# EAGLE design Geiger_Counter (EAGLE 6.6.0)
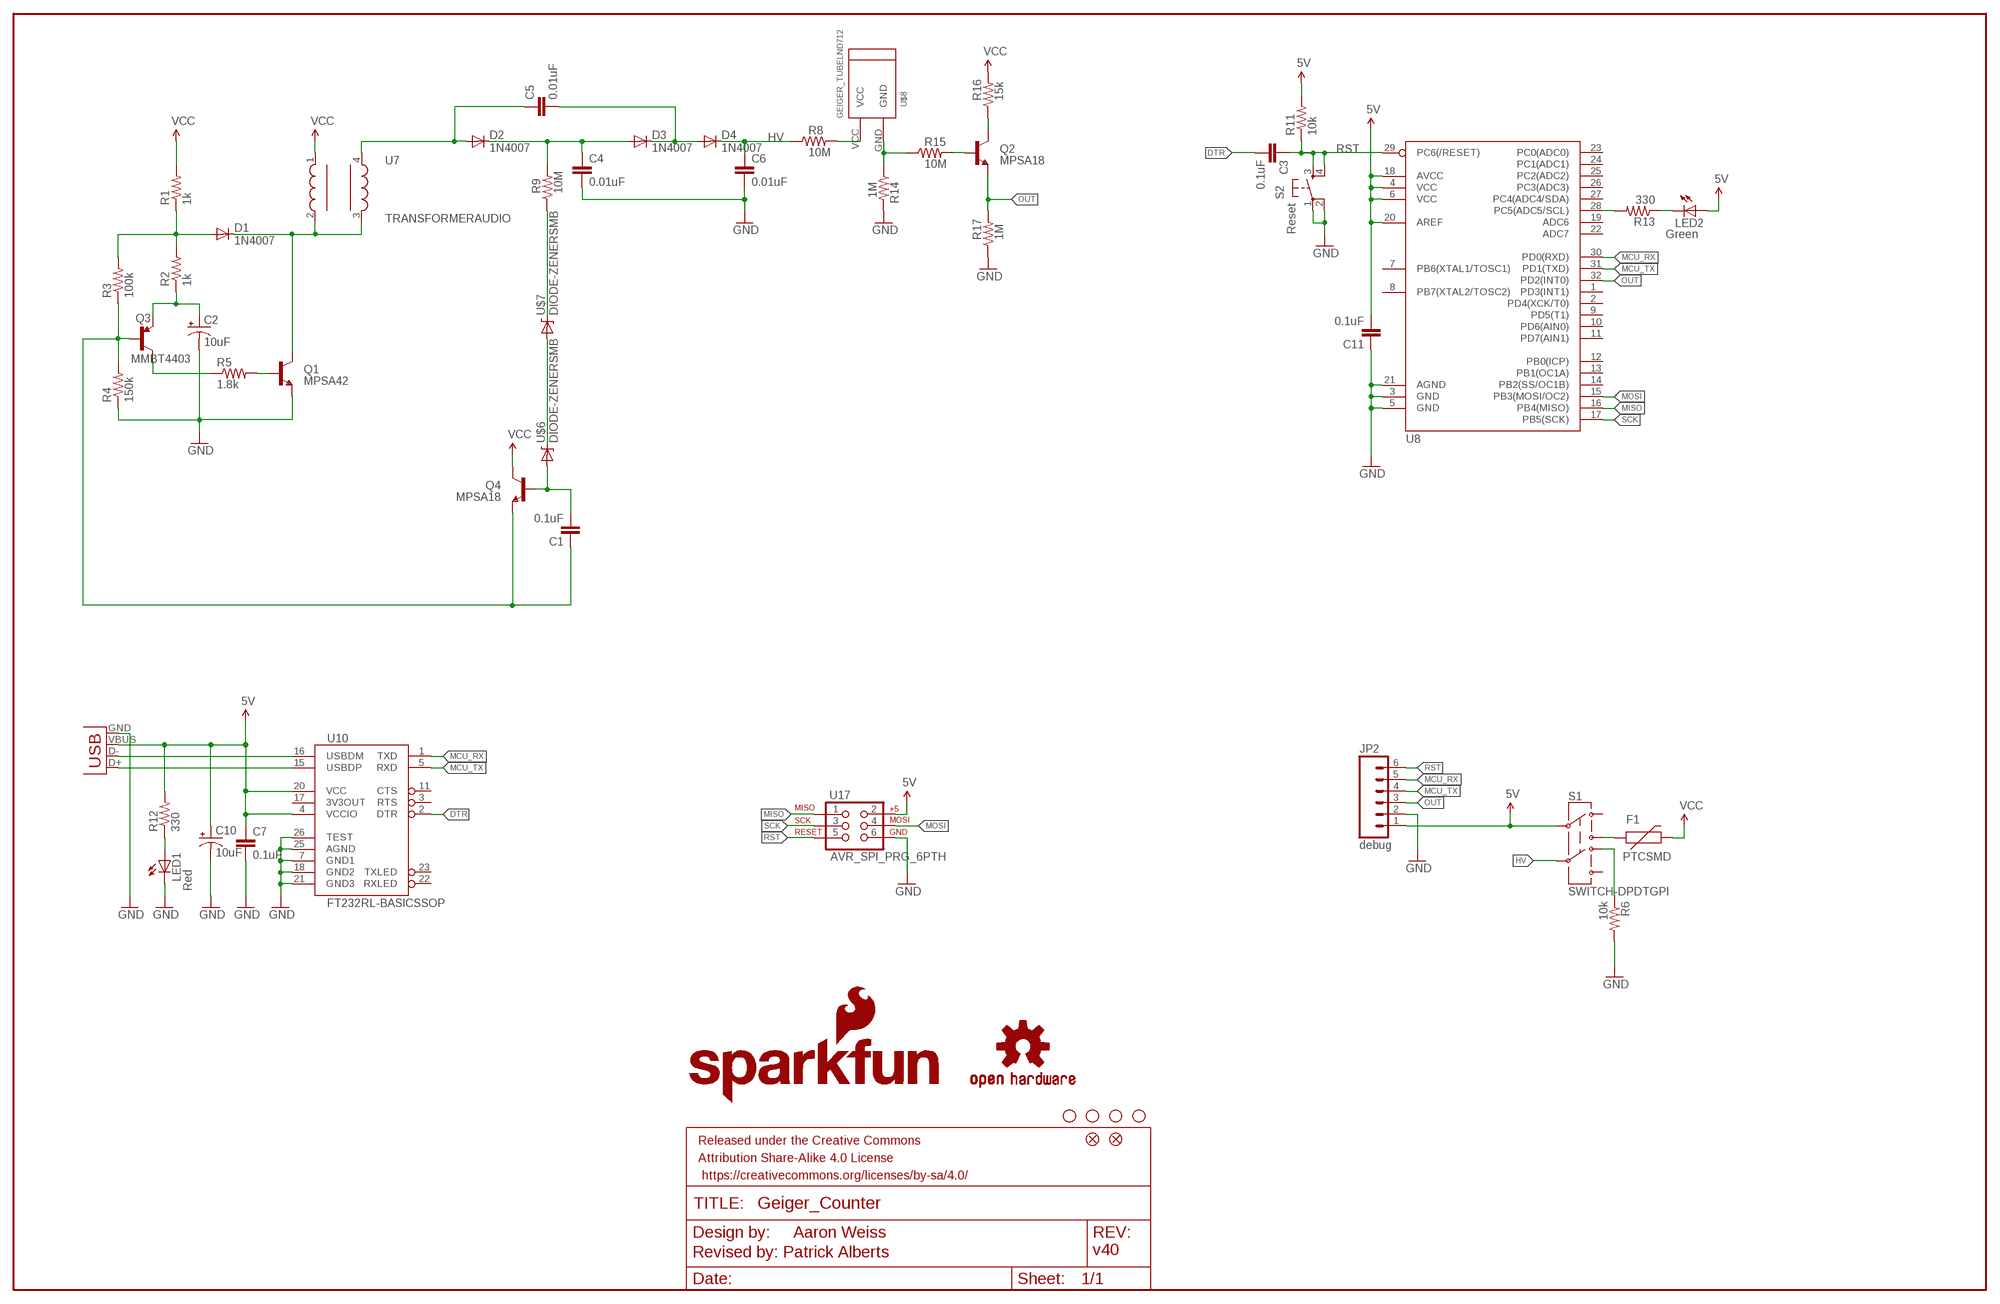
[diagram p0: schematic, sheet 1]

## Parts
C1  0.1uF  0.1UF-25V(+80/-20%)(0603)  [0603-CAP]
C2  10uF  CAP_POL1206  [EIA3216]
C3  0.1uF  0.1UF-25V(+80/-20%)(0603)  [0603-CAP]
C4  0.01uF  CAPPTH3  [CAP-PTH-LARGE]
C5  0.01uF  CAPPTH3  [CAP-PTH-LARGE]
C6  0.01uF  CAPPTH3  [CAP-PTH-LARGE]
C7  0.1uF  0.1UF-25V(+80/-20%)(0603)  [0603-CAP]
C10  10uF  CAP_POL1206  [EIA3216]
C11  0.1uF  0.1UF-25V(+80/-20%)(0603)  [0603-CAP]
D1  1N4007  DIODEHV  [DIODE-HV]
D2  1N4007  DIODEPTH  [DIODE-1N4001]
D3  1N4007  DIODEPTH  [DIODE-1N4001]
D4  1N4007  DIODEPTH  [DIODE-1N4001]
F1  PTCSMD  [PTC-1206]
FID1  FIDUCIAL1X2  [FIDUCIAL-1X2]
FID2  FIDUCIAL1X2  [FIDUCIAL-1X2]
FRAME2  FRAME-LEDGER  [CREATIVE_COMMONS]
JP2  debug  M06SIP  [1X06]
LED1  Red  LED1206  [LED-1206]
LED2  Green  LED1206  [LED-1206]
LOGO1  OSHW-LOGOM  [OSHW-LOGO-M]
LOGO2  SFE_LOGO_NAME_FLAME.1_INCH  [SFE_LOGO_NAME_FLAME_.1]
Q1  MPSA42  TRANSISTOR_NPNSOT23-3  [SOT23-3]
Q2  MPSA18  TRANSISTOR_NPNTO92  [TO-92]
Q3  MMBT4403  TRANSISTOR_PNPSMD  [SOT23-3]
Q4  MPSA18  TRANSISTOR_NPNTO92  [TO-92]
R1  1k  1KOHM1/10W1%(0603)  [0603-RES]
R2  1k  1KOHM1/10W1%(0603)  [0603-RES]
R3  100k  100KOHM1/10W1%(0603)  [0603-RES]
R4  150k  150KOHM1/10W1%(0603)  [0603-RES]
R5  1.8k  1.8KOHM1/10W1%(0603)  [0603-RES]
R6  10k  RESISTORAXIAL-0.3  [AXIAL-0.3]
R8  10M  RESISTORAXIAL-0.3  [AXIAL-0.3]
R9  10M  RESISTORAXIAL-0.3  [AXIAL-0.3]
R11  10k  10KOHM1/10W1%(0603)0603  [0603-RES]
R12  330  33OHM1/10W1%(0603)  [0603]
R13  330  330OHM1/10W1%(0603)  [0603-RES]
R14  1M  RESISTORAXIAL-0.3  [AXIAL-0.3]
R15  10M  RESISTORAXIAL-0.3  [AXIAL-0.3]
R16  15k  RESISTORAXIAL-0.3  [AXIAL-0.3]
R17  1M  RESISTORAXIAL-0.3  [AXIAL-0.3]
S1  SWITCH-DPDTGPI  [GPI-152-3013]
S2  Reset  TAC_SWITCHSMD  [TACTILE_SWITCH_SMD]
U7  TRANSFORMERAUDIO  TRANSFORMERPTH  [TRANSFORMER]
U8  ATMEGA328_SMT  [TQFP32-08]
U10  FT232RL-BASICSSOP  [SSOP28DB]
U17  AVR_SPI_PRG_6PTH  [2X3]
U$1  STAND-OFF  [STAND-OFF]
U$2  STAND-OFF  [STAND-OFF]
U$3  STAND-OFF  [STAND-OFF]
U$4  STAND-OFF  [STAND-OFF]
U$6  DIODE-ZENERSMB  [SMB-DIODE]
U$7  DIODE-ZENERSMB  [SMB-DIODE]
U$8  GEIGER_TUBELND712  [GEIGER_TUBE]
X1  USBSMD  [USB-MINIB]

## Nets
5V: C7.1 C10.A(+) C11.2 JP2.1 LED2.A R11.2 R12.2 S1.C@1 U8.4(VCC) U8.6(VCC) U8.18(AVCC) U8.20(AREF) U10.4(VCCIO) U10.20(VCC) U17.2 X1.VBUS
DTR: C3.2 U10.2(DTR)
GND: C2.C(-) C4.2 C6.2 C10.C(-) C11.1 JP2.2 LED1.C Q1.2(E) R4.1 R6.P$2 R14.P$2 R17.P$1 S2.1 S2.2 U8.3(GND) U8.5(GND) U8.21(AGND) U10.7(GND1) U10.18(GND2) U10.21(GND3) U10.25(AGND) U10.26(TEST) U17.6 X1.GND
HV: C6.1 D4.C R8.P$1 S1.C@2
MCU_RX: JP2.5 U8.30(PD0(RXD)) U10.1(TXD)
MCU_TX: JP2.4 U8.31(PD1(TXD)) U10.5(RXD)
MISO: U8.16(PB4(MISO)) U17.1
MOSI: U8.15(PB3(MOSI/OC2)) U17.4
N$1: F1.1 S1.20
N$2: D1.A R1.1 R2.2 R3.2
N$3: R14.P$1 R15.P$1 U$8.GND
N$4: C2.A(+) Q3.2(E) R2.1
N$5: Q2.2(B) R15.P$2
N$6: Q3.3(C) R5.1
N$7: R6.P$1 S1.11
N$8: Q2.3(C) R16.P$1
N$9: Q1.1(B) R5.2
N$10: D1.C Q1.3(C) U7.2 U7.3
N$11: C4.1 D2.C D3.A R9.P$2
N$12: C5.2 D3.C D4.A
N$13: C7.2 ; supply symbol labelled GND
N$14: R8.P$2 U$8.VCC
N$15: U10.16(USBDM) X1.D-
N$17: U10.15(USBDP) X1.D+
N$18: R9.P$1 U$7.C
N$19: LED1.A R12.1
N$20: LED2.C R13.1
N$21: R13.2 U8.28(PC5(ADC5/SCL))
N$22: U$6.C U$7.A
N$23: C1.2 Q4.2(B) U$6.A
OSC1: C5.1 D2.A U7.4
OSC2: C1.1 Q3.1(B) Q4.1(E) R3.1 R4.2
OUT: JP2.3 Q2.1(E) R17.P$2 U8.32(PD2(INT0))
RST: C3.1 JP2.6 R11.1 S2.3 S2.4 U8.29(PC6(/RESET)) U17.5
SCK: U8.17(PB5(SCK)) U17.3
VCC: F1.2 Q4.3(C) R1.2 R16.P$2 U7.1
Unconnected: S1.10 S1.21 U8.1(PD3(INT1)) U8.2(PD4(XCK/T0)) U8.7(PB6(XTAL1/TOSC1)) U8.8(PB7(XTAL2/TOSC2)) U8.9(PD5(T1)) U8.10(PD6(AIN0)) U8.11(PD7(AIN1)) U8.12(PB0(ICP)) U8.13(PB1(OC1A)) U8.14(PB2(SS/OC1B)) U8.19(ADC6) U8.22(ADC7) U8.23(PC0(ADC0)) U8.24(PC1(ADC1)) U8.25(PC2(ADC2)) U8.26(PC3(ADC3)) U8.27(PC4(ADC4/SDA)) U10.3(RTS) U10.11(CTS) U10.17(3V3OUT) U10.22(RXLED) U10.23(TXLED)

## Notes on the sheet
- Aaron Weiss
- Revised by: Patrick Alberts | v40

## Library data of the parts
C1 C3 C7 C11 = SparkFun-Capacitors:0.1UF-25V(+80/-20%)(0603): CAP-00810 Ceramic Standard decoupling cap; PROD_ID: CAP-00810
C2 C10 = SparkFun:CAP_POL: Capacitor Polarized These are standard SMD and PTH capacitors. Normally 10uF, 47uF, and 100uF in electrolytic and tantalum varieties. Always verify the external diameter of the through hole cap, it varies with capacity, voltage, and manufacturer. The EIA devices should be standard.
C4-C6 = SparkFun:CAP: Capacitor Standard 0603 ceramic capacitor, and 0.1" leaded capacitor.
D1-D4 = SparkFun:DIODE: Diode These are standard reverse protection diodes and small signal diodes. SMA package can handle up to about 1A. SOD-323 can handle about 200mA. What the SOD-323 package when ordering, there are some mfgs out there that are 5-pin packages.
F1 = SparkFun:PTC: Resettable Fuse PTC Resettable Fuse. Spark Fun Electronics SKU : COM-08357
FID1 FID2 = SparkFun-Aesthetics:FIDUCIAL: Fiducial Alignment Points Various fiducial points for machine vision alignment.
FRAME2 = SparkFun-Aesthetics:FRAME-LEDGER: Schematic Frame Standard 11x14 US Ledger frame
JP2 = SparkFun:M06: Header 6 Standard 6-pin 0.1" header. Use with straight break away headers (SKU : PRT-00116), right angle break away headers (PRT-00553), swiss pins (PRT-00743), machine pins (PRT-00117), and female headers (PRT-00115). Molex polarized connector foot print use with SKU : PRT-08094 with associated crimp pins and housings. NOTES ON THE VARIANTS LOCK and LOCK_LONGPADS... This footprint was designed to help hold the alignment of a through-hole component (i.e. 6-pin header) while soldering it into place. You may notice that each hole has been shifted either up or down by 0.005 of an inch from it's more standard position (which is a perfectly straight line). This slight alteration caused the pins (the squares in the middle) to touch the edges of the holes. Because they are alternating, it causes a "brace" to hold the component in place. 0.005 has proven to be the perfect amount of "off-center" position when using our standard breakaway headers. Although looks a little odd when you look at the bare footprint, once you have a header in there, the alteration is very hard to notice. Also, if you push a header all the way into place, it is covered up entirely on the bottom side. This idea of altering the position of holes to aid alignment will be further integrated into the Sparkfun Library for other footprints. It can help hold any component with 3 or more connection pins.
LED1 LED2 = SparkFun:LED: LEDs Standard schematic elements and footprints for 5mm, 3mm, 1206, and 0603 sized LEDs. 5mm - Spark Fun Electronics SKU : COM-00529 (and others)
LOGO1 = SparkFun-Aesthetics:OSHW-LOGO: Open Source Hardware Logo This logo indicates the piece of hardware it is found on incorporates a OSHW license and/or adheres to the definition of open source hardware found here: http://freedomdefined.org/OSHW
LOGO2 = SparkFun-Aesthetics:SFE_LOGO_NAME_FLAME: SFE Logo, name and flame This is the SparkFun full logo. The logo on the schematic will always be the same size; the package variant is the height of the flame part of the logo. Default layer for the logo on the board is tSilk.
Q1 Q2 Q4 = SparkFun:TRANSISTOR_NPN: Transistor NPN BJT configuration in SOT23 package. MMBT2222 is the common NPN we use. Double check BCE configuration again layout.
Q3 = SparkFun:TRANSISTOR_PNP
R1 R2 = SparkFun-Resistors:1KOHM1/10W1%(0603): RES-07856; PROD_ID: RES-07856; VALUE: 1K
R3 = SparkFun-Resistors:100KOHM1/10W1%(0603): RES-07828; PROD_ID: RES-07828
R4 = SparkFun-Resistors:150KOHM1/10W1%(0603): RES-09117; PROD_ID: RES-09117
R5 = SparkFun-Resistors:1.8KOHM1/10W1%(0603): RES-09119; PROD_ID: RES-09119
R6 R8 R9 R14-R17 = SparkFun:RESISTOR: Resistor Basic schematic elements and footprints for 0603, 1206, and PTH resistors.
R11 = SparkFun-Resistors:10KOHM1/10W1%(0603): RES-00824; PROD_ID: RES-00824; VALUE: 10K
R12 = SparkFun-Resistors:33OHM1/10W1%(0603): RES-08270; PROD_ID: RES-08270; VALUE: 33OHM
R13 = SparkFun-Resistors:330OHM1/10W1%(0603): RES-00818; PROD_ID: RES-00818
S1 = SparkFun:SWITCH-DPDT: DPDT Version of the COM-00597
S2 = SparkFun:TAC_SWITCH: Momentary Switch Button commonly used for reset or general input. Spark Fun Electronics SKU : COM-00097
U7 = SparkFun:TRANSFORMER
U8 = SparkFun-DigitalIC:ATMEGA328_SMT: 32-Pin Atmega328 part Commonly used on Arduino compatible boards Available in QFP and QFN packages TQFP is IC-09069 QFN is non-stock; PROD_ID: IC-09069; VALUE: ATMEGA328P
U10 = SparkFun:FT232RL-BASIC: USB UART This is the simplified version of the FT232RL unit. Only what you need, nothing you don't. Spark Fun Electronics SKU : COM-00650
U17 = SparkFun:AVR_SPI_PRG_6: AVR ISP 6 Pin This is the reduced ISP connector for AVR programming. Common on Arduino. This footprint will take up less PCB space and can be used with a 10-pin to 6-pin adapter such as SKU: BOB-08508
U$1-U$4 = SparkFun:STAND-OFF: Stand Off This is the mechanical footprint for a #4 phillips button head screw. Use the keepout ring to avoid running the screw head into surrounding components. SKU : PRT-00447
U$6 U$7 = SparkFun-DiscreteSemi:DIODE-ZENER: Zener Diode Production Part - 8199 3.4V Zener Voltage
U$8 = SparkFun:GEIGER_TUBE: LND712 Geiger Tube
X1 = SparkFun:USB: USB Connectors USB-B-PTH is fully proven SKU : PRT-00139 USB-miniB is fully proven SKU : PRT-00587 USB-A-PCB is untested. USB-A-H is throughly reviewed, but untested. Spark Fun Electronics SKU : PRT-00437 USB-B-SMT is throughly reviewed, but untested. Needs silkscreen touching up. USB-A-S has not been used/tested USB-MB-H has not been used/tested

## Board
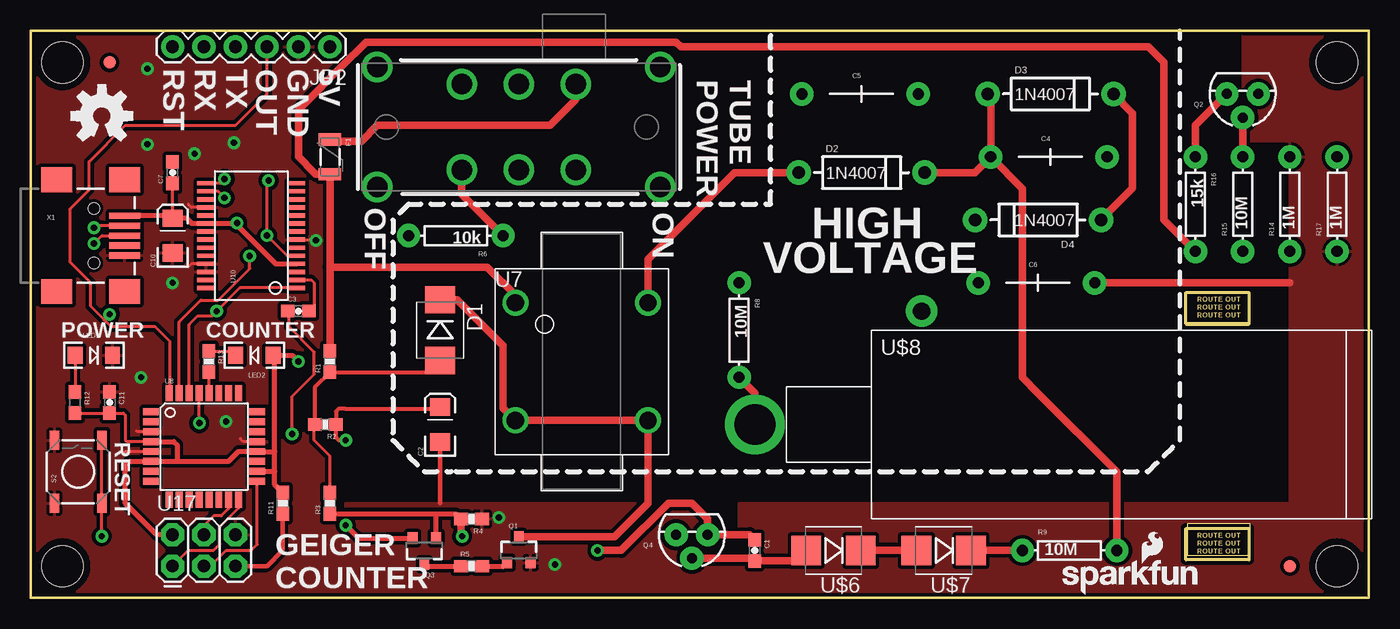
[diagram p1: board, top side]
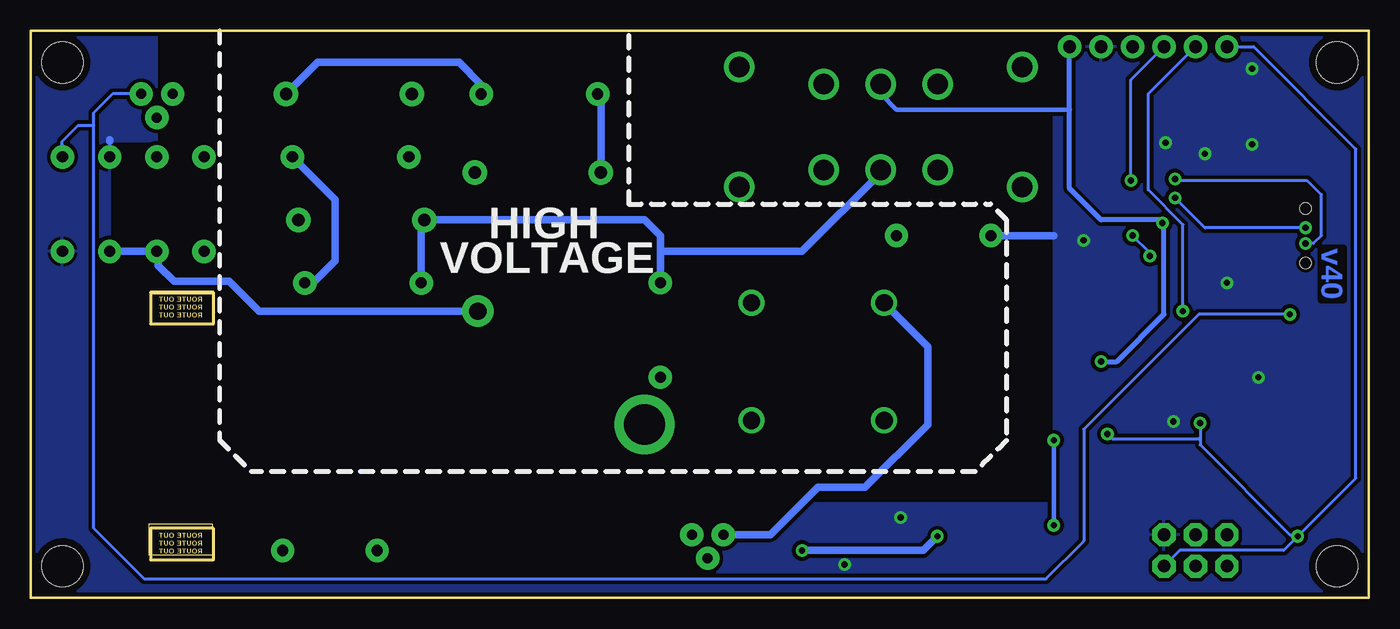
[diagram p2: board, bottom side, seen from below]

Size 107.95 x 45.72 mm. Coordinates in mm from the lower left corner, seen from the top.
Outline: 0,0 107.95,0 107.95,45.72 0,45.72 0,0
Outline: 93.22,24.64 98.3,24.64 98.3,22.1 93.22,22.1 93.22,24.64
Outline: 93.22,5.59 98.3,5.59 98.3,3.05 93.22,3.05 93.22,5.59
Copper layers (1*16): Top 0.035mm / dielectric 1.5mm / Bottom 0.035mm
Design rules "SparkFun-2-layer": minimum track width 7mil, minimum drill 15mil, track to track 8mil, track to pad 8mil, pad to pad 8mil, via to via 8mil, smd to smd 8mil, copper to edge 8mil, drill to drill 8mil, minimum pad ring 12mil, minimum via ring 10mil, stop-mask expansion 4mil, vias tented up to drill 20mil, thermal gap 10mil
Milling: area 93.2,22 to 98.3,24.5; area 93.3,3.4 to 98.4,6

### Footprints (pad centres in the part's own frame; a part is rotated, then mirrored left to right if it is on the bottom)
0603-CAP = smd 1.1 x 1: 1 -0.85,0; 2 0.85,0
EIA3216 = smd 1.4 x 1.6: A 1.4,0; C -1.4,0
CAP-PTH-LARGE = drill 0.9 pad 1.905: 1 -4.826,0; 2 4.572,0
DIODE-HV = smd 2.2 x 2.4: A 2.454,0; C -2.454,0
DIODE-1N4001 = drill 1 pad 1.981: A -5.08,0; C 5.08,0
PTC-1206 = smd 1 x 1.8: 1 -1.4,0; 2 1.4,0
FIDUCIAL-1X2 = smd 1 x 1: 1 0,0
1X06 = drill 1.016 pad 1.88: 1 0,0; 2 2.54,0; 3 5.08,0; 4 7.62,0; 5 10.16,0; 6 12.7,0
LED-1206 = smd 1.2 x 1.4: A -1.5,0; C 1.5,0
SOT23-3 = smd 0.8 x 0.9: 1 -0.95,-1; 2 0.95,-1; 3 0,1.1
TO-92 = drill 0.813 pad 1.88: 1 -1.27,0; 2 0,1.905; 3 1.27,0
0603-RES = smd 1.1 x 1: 1 -0.85,0; 2 0.85,0
AXIAL-0.3 = drill 0.9 pad 1.88: P$1 -3.81,0; P$2 3.81,0
0603 = smd 1.1 x 1: 1 -0.85,0; 2 0.85,0
GPI-152-3013 = drill 1.65: 10 -4.6,3.455; 11 -4.6,-3.455; 20 4.6,3.455; 21 4.6,-3.455; C@1 0,3.455; C@2 0,-3.455; P$7 11.43,4.85; P$8 -11.43,4.85; P$9 -11.43,-4.85; P$10 11.43,-4.85
TACTILE_SWITCH_SMD = smd 1.524 x 0.762: 1 -2.54,1.905; 2 2.54,1.905; 3 -2.54,-1.905; 4 2.54,-1.905
TRANSFORMER = drill 1.4: 1 -5.35,4.75; 2 -5.35,-4.75; 3 5.35,-4.75; 4 5.35,4.75
TQFP32-08 = smd 1.27 x 0.559: 1 -4.293,2.8; 2 -4.293,2; 3 -4.293,1.2; 4 -4.293,0.4; 5 -4.293,-0.4; 6 -4.293,-1.2; 7 -4.293,-2; 8 -4.293,-2.8; 17 4.293,-2.8; 18 4.293,-2; 19 4.293,-1.2; 20 4.293,-0.4; 21 4.293,0.4; 22 4.293,1.2; 23 4.293,2; 24 4.293,2.8 | smd 0.559 x 1.27: 9 -2.8,-4.293; 10 -2,-4.293; 11 -1.2,-4.293; 12 -0.4,-4.293; 13 0.4,-4.293; 14 1.2,-4.293; 15 2,-4.293; 16 2.8,-4.293; 25 2.8,4.293; 26 2,4.293; 27 1.2,4.293; 28 0.4,4.293; 29 -0.4,4.293; 30 -1.2,4.293; 31 -2,4.293; 32 -2.8,4.293
SSOP28DB = smd 0.348 x 1.397: 1 -4.225,-3.656; 2 -3.575,-3.656; 3 -2.925,-3.656; 4 -2.275,-3.656; 5 -1.625,-3.656; 6 -0.975,-3.656; 7 -0.325,-3.656; 8 0.325,-3.656; 9 0.975,-3.656; 10 1.625,-3.656; 11 2.275,-3.656; 12 2.925,-3.656; 13 3.575,-3.656; 14 4.225,-3.656; 15 4.225,3.656; 16 3.575,3.656; 17 2.925,3.656; 18 2.275,3.656; 19 1.625,3.656; 20 0.975,3.656; 21 0.325,3.656; 22 -0.325,3.656; 23 -0.975,3.656; 24 -1.625,3.656; 25 -2.275,3.656; 26 -2.925,3.656; 27 -3.575,3.656; 28 -4.225,3.656
2X3 = drill 1.016 pad 1.88 octagon: 1 0,0; 2 0,2.54; 3 2.54,0; 4 2.54,2.54; 5 5.08,0; 6 5.08,2.54
STAND-OFF = hole 3.302: 0,0
SMB-DIODE = smd 2.4 x 2.4: A 2.2,0; C -2.2,0
GEIGER_TUBE = drill 1.4 pad 2.54: GND 13.462,9.144 | drill 3.302 pad 4.826: VCC 0,0
USB-MINIB = smd 2.5 x 0.5: D+ 2.5,0; D- 2.5,0.8; GND 2.5,-1.6; ID 2.5,-0.8; VBUS 2.5,1.6 | smd 2.5 x 2: MTN1 -3,4.5; MTN2 2.5,4.5; MTN3 -3,-4.5; MTN4 2.5,-4.5 | hole 0.9: 0,2.2; 0,-2.2

### Placement (x,y rotation side)
C1  58.42,3.81 270 top
C2  33.02,13.97 90 top
C3  21.59,23.11 0 top
C4  82.28,35.56 0 top
C5  67.04,40.64 0 top
C6  81.28,25.4 0 top
C7  11.43,34.29 90 top
C10  11.43,29.21 90 top
C11  6.35,15.75 270 top
D1  33.02,21.59 270 top
D2  67.04,34.29 0 top
D3  82.28,40.64 0 top
D4  81.28,30.48 180 top
F1  24.13,35.56 270 top
FID1  6.35,43.18 0 top
FID2  101.6,2.54 0 top
FRAME2  21.79,-19.05 0 top  (outside the outline)
JP2  24.13,44.45 180 top
LED1  5.08,19.56 0 top
LED2  18.03,19.56 180 top
LOGO1  5.71,38.86 0 top
LOGO2  82.8,0.13 0 top
Q1  39.37,3.81 0 top
Q2  97.79,40.64 180 top
Q3  31.75,3.81 180 top
Q4  53.34,5.08 180 top
R1  24.13,19.05 90 top
R2  23.75,13.97 180 top
R3  24.13,7.62 90 top
R4  35.56,6.35 180 top
R5  35.56,2.54 0 top
R6  34.29,29.21 180 top
R8  57.15,21.59 270 top
R9  83.82,3.81 0 top
R11  20.32,7.62 90 top
R12  3.56,15.75 270 top
R13  14.35,19.05 270 top
R14  101.6,31.75 90 top
R15  97.79,31.75 90 top
R16  93.98,31.75 270 top
R17  105.41,31.75 90 top
S1  39.37,37.97 0 top
S2  3.81,10.16 90 top
U7  44.45,19.05 0 top
U8  13.97,12.19 0 top
U10  17.78,29.21 90 top
U17  11.43,2.54 0 top
U$1  2.54,2.54 0 top
U$2  2.54,43.18 0 top
U$3  105.41,43.18 0 top
U$4  105.41,2.54 0 top
U$6  64.77,3.81 180 top
U$7  73.66,3.81 180 top
U$8  58.42,13.97 0 top
X1  5.08,29.21 0 top

### Tracks (layer width: path | path; a pad name or v marks a point on that pad's centre or on a via)
5V  (via drill 0.51)
  Top 0.254: 11.23,30.81 C10.A C7.1 | 16.6,30.18 v16.64,30.23 16.64,30.06 | R12.2 C11.2 7.45,14.9 7.62,14.73 7.62,12.7 7.73,12.59 U8.4
  Top 0.406: 11.23,30.81 X1.VBUS | C10.A 12.57,30.61 12.99,30.18 U10.20 16.6,30.18 | U10.4 19.76,26.93 16.64,30.06 | 20.32,8.26 R11.2 19.68,9.11 19.68,10.19 | U17.2 10.16,5.08 7.62,7.62 7.62,10.67 7.94,10.99 U8.6 11.89,11 | 19.68,10.19 19.68,11.79 | 18.3,10.16 U8.18 19.68,10.19 | 19.68,11.79 U8.20 16.75,11.8 15.95,11 11.89,11 | v21.59,19.05 21.08,19.56 LED2.A 19.68,19.41 19.68,11.79 | U8.4 11.54,12.59 11.79,12.34 11.79,11.1 11.89,11
  Bottom 0.381: S1.C@1 39.37,40.64 38.1,39.37 24.13,39.37
  Bottom 0.406: v21.59,19.05 20.32,19.05 16.51,22.86 16.51,30.1 v16.64,30.23 16.89,30.48 21.59,30.48 24.13,33.02 24.13,39.37 JP2.1
DTR
  Top 0.254: U10.2 22.62,25.64 22.86,25.4 22.86,23.53 C3.2
GND  (via drill 0.51)
  Top 0.254: U8.3 8.58,13.39 8.51,13.46 | U8.5 7.6,11.79 7.49,11.68 | U8.21 17.13,12.59 16.89,12.83 | U10.18 12.96,31.48 12.7,31.75 | U10.25 12.96,26.93 12.7,26.67 | U10.7 22.93,28.89 v22.99,28.83
  Top 0.356: 33.02,7.62 C2.C
  Top 0.61: C6.2 101.6,25.4
  Bottom 0.61: 25.4,29.21 R6.P$2 | 101.6,36.83 101.6,36.96 | C6.2 85.17,25.4 83.39,27.18 83.39,32.1 C4.2
  other vias: 15.75,14.22 11.43,25.4 42.29,2.67 9.4,42.67 9.4,36.58 16.38,36.7 13.21,35.81 37.77,6.48 8.89,17.78
  pour Bottom (isolate 0.305): 0,45.72 25.4,45.72 25.4,0 0,0
  pour Top (isolate 0.305): 0,45.72 0,0 25.4,0 25.4,45.72
  pour Top (isolate 0.305): 25.4,0 25.4,7.62 58.42,7.62 58.42,0
  pour Bottom (isolate 0.305): 25.4,0 25.4,7.62 58.42,7.62 58.42,0
  pour Bottom (isolate 0.305): 0,7.62 101.6,7.62 101.6,36.83 97.79,36.83 97.79,45.72 107.95,45.72 107.95,0 0,0
  pour Top (isolate 0.305): 57.15,7.62 101.6,7.62 101.6,36.83 97.79,36.83 97.79,45.72 107.95,45.72 107.95,0 57.15,0
HV
  Bottom 0.61: S1.C@2 39.37,34.29 45.72,27.94 57.15,27.94 | C6.1 76.45,30.23 D4.C 58.42,30.48 57.15,29.21 57.15,27.94 | R8.P$1 57.15,27.94
MCU_RX  (via drill 0.51)
  Top 0.254: U8.30 12.77,22.04 13.46,22.73 14.61,22.73 v14.99,23.11 16.86,24.98 U10.1
  Bottom 0.254: v14.99,23.11 14.99,30.1 17.78,32.89 17.78,40.64 JP2.5 | v14.99,23.11 15.11,22.99 | v14.99,23.11 14.99,22.99
MCU_TX  (via drill 0.51)
  Top 0.254: U10.5 20.68,27.59 v19.05,29.21 19.05,33.53 v19.18,33.66 | U8.31 11.97,22.26 13.72,24 15.11,24 17.65,26.54 v17.65,27.56
  Bottom 0.254: v17.65,27.56 17.65,27.81 v19.05,29.21 | v19.18,33.66 19.18,41.78 JP2.4
MISO
  Top 0.254: U17.1 12.7,3.81 14.73,3.81 15.24,4.32 15.24,5.71 16.77,7.25 U8.16
MOSI
  Top 0.254: U8.15 15.97,7.21 15.37,6.6 14.73,6.6 13.97,5.84 U17.4
N$1
  Top 0.381: F1.1 24.26,36.83
  Top 0.61: S1.20 43.97,40.16 41.91,38.1 27.94,38.1 26.67,36.83 24.26,36.83
N$2
  Top 0.254: R3.2 24.13,11.43 22.86,12.7 22.86,13.93 R2.2
  Top 0.305: 32.53,18.65 32.08,18.2 R1.1 22.9,16.97 R2.2
  Top 0.356: 32.28,18.4 32.53,18.65 D1.A
N$3
  Bottom 0.61: R14.P$1 R15.P$1 97.66,27.81 97.66,26.8 96.39,25.53 91.95,25.53 89.53,23.11 89.15,23.11 U$8.GND
N$4  (via drill 0.51)
  Top 0.305: 32.89,15.24 25.4,15.24 24.82,15.24 24.61,15.04 24.61,13.98 R2.1 24.61,13.96 24.61,12.93 24.84,12.7 v25.4,12.7
  Top 0.356: 32.89,15.24 C2.A
  Top 0.406: Q3.2 26.43,4.81 v25.4,5.84
  Bottom 0.356: v25.4,5.84 v25.4,12.7
N$5
  Top 0.61: R15.P$2 Q2.2
N$6
  Top 0.406: Q3.3 31.92,2.54 R5.1
N$7
  Top 0.61: S1.11 34.77,32.54 R6.P$1
N$8
  Top 0.61: R16.P$1 93.98,38.1 Q2.3
N$9
  Top 0.406: R5.2 38.15,2.54 Q1.1
N$10
  Top 0.61: D1.C 34.38,24.04 38.1,20.32 38.1,15.3 U7.2 U7.3 49.8,7.62 47.09,4.91 Q1.3
N$11
  Top 0.61: C4.1 77.45,40.39 D3.A | D2.C 76.18,34.29 C4.1 | R9.P$2 87.63,10.16 81.28,16.51 80.01,17.78 80.01,33 C4.1
N$12
  Top 0.61: D4.A 88.9,33.02 88.9,39.1 D3.C
  Bottom 0.61: C5.2 71.61,41.4 73.39,43.18 84.82,43.18 D3.C
N$14
  Top 0.61: U$8.VCC 58.42,16.51 R8.P$2
N$15  (via drill 0.51)
  Top 0.254: X1.D- 5.25,30.01 v5.08,29.84 | U10.16 15.09,32.78 v15.62,32.26
  Bottom 0.254: v5.08,29.84 13.21,29.84 v15.62,32.26
N$17  (via drill 0.51)
  Top 0.254: X1.D+ 5.71,29.21 v5.08,28.57 | U10.15 15.27,33.44 v15.62,33.78
  Bottom 0.254: v5.08,28.57 4.45,28.57 3.81,29.21 3.81,32.51 4.95,33.66 15.49,33.66 v15.62,33.78
N$18
  Top 0.61: R9.P$1 U$7.C
N$19
  Top 0.254: LED1.A 3.58,16.62 R12.1
N$20
  Top 0.254: R13.1 16.19,19.9 LED2.C
N$21
  Top 0.254: U8.28 14.37,18.18 R13.2
N$22
  Top 0.61: U$7.A U$6.C
N$23
  Top 0.61: Q4.2 58.2,3.17 C1.2 61.72,2.96 U$6.A
OSC1
  Top 0.61: U7.4 49.8,24.4 49.8,27.32 56.64,34.16 56.77,34.29 57.15,34.29 59.69,34.29 D2.A
  Bottom 0.61: D2.A 61.96,40.39 C5.1
OSC2  (via drill 0.51)
  Top 0.406: R3.1 32.7,6.77 | 32.7,6.77 34.29,6.77 R4.2 | Q3.1 32.7,6.77
  Top 0.61: v45.72,3.81 47.62,3.81 51.44,7.62 53.34,7.62 54.61,6.35 Q4.1 58,5.08 C1.1 | R4.2 34.71,4.95 v34.8,4.95
  Bottom 0.61: v45.72,3.81 35.94,3.81 v34.8,4.95
OUT  (via drill 0.51)
  Top 0.254: 5.91,22.42 6.48,21.84 10.03,21.84 11.18,20.7 U8.32 | 5.91,22.42 4.83,23.5 4.83,25.4 3.17,27.05 3.17,31.37 4.7,32.89 4.7,35.18 7.62,38.1 16.51,38.1 19.05,40.64 JP2.3 | v6.35,22.86 5.91,22.42
  Bottom 0.254: 102.87,38.1 102.87,5.59 98.81,1.52 26.04,1.52 22.99,4.57 22.99,13.59 13.72,22.86 v6.35,22.86 | 102.87,38.1 102.87,39.13 101.36,40.64 Q2.1 | R17.P$2 105.41,36.83 104.14,38.1 102.87,38.1
RST  (via drill 0.51)
  Top 0.254: S2.4 S2.3 v5.71,4.95 | U8.29 13.57,14.12 v13.59,14.1 | v21.08,13.21 21.08,16.26 22.86,18.03 22.86,19.81 20.83,21.84 20.83,23.03 C3.1
  Top 0.356: U17.5 19.05,2.54 20.32,3.81 R11.1
  Bottom 0.254: U17.5 15.24,3.81 6.86,3.81 v5.71,4.95 | v5.71,4.95 1.02,9.65 1.02,36.2 9.27,44.45 JP2.6 | v21.08,13.21 20.7,12.83 13.72,12.83 13.59,12.7 | v13.59,14.1 13.59,12.7 | 13.59,12.7 13.59,12.32 6.35,5.08 5.84,5.08 v5.71,4.95
SCK
  Top 0.254: U17.3 14.48,2.54 15.75,3.81 17.78,3.81 18.26,4.29 U8.17
VCC
  Top 0.61: 24.13,26.67 R1.2 | 24.13,26.67 F1.2 22.99,34.16 22.86,34.29 21.59,35.56 21.59,39.37 25.4,43.18 26.67,44.45 27.05,44.83 52.07,44.83 52.45,44.45 90.17,44.45 91.44,43.18 91.44,30.48 92.71,29.21 R16.P$2 | U7.1 39.1,24.4 36.83,26.67 24.13,26.67
  Bottom 0.61: Q4.3 48.26,5.08 44.45,8.89 40.64,8.89 35.56,13.97 35.56,20.26 U7.1

### Text on the board
Bottom: v40
Dimension: ROUTE OUT | ROUTE OUT | ROUTE OUT | ROUTE OUT | ROUTE OUT | ROUTE OUT
tPlace: RST | RX | TX | OUT | GND | 5V | TUBE / POWER | OFF | ON | HIGH | VOLTAGE | POWER | COUNTER | RESET | GEIGER / COUNTER
bPlace: HIGH | VOLTAGE
tDocu: Aaron Weiss | Revised by: Patrick Alberts